# EAGLE schematic wifi-board (EAGLE 7.1.0)
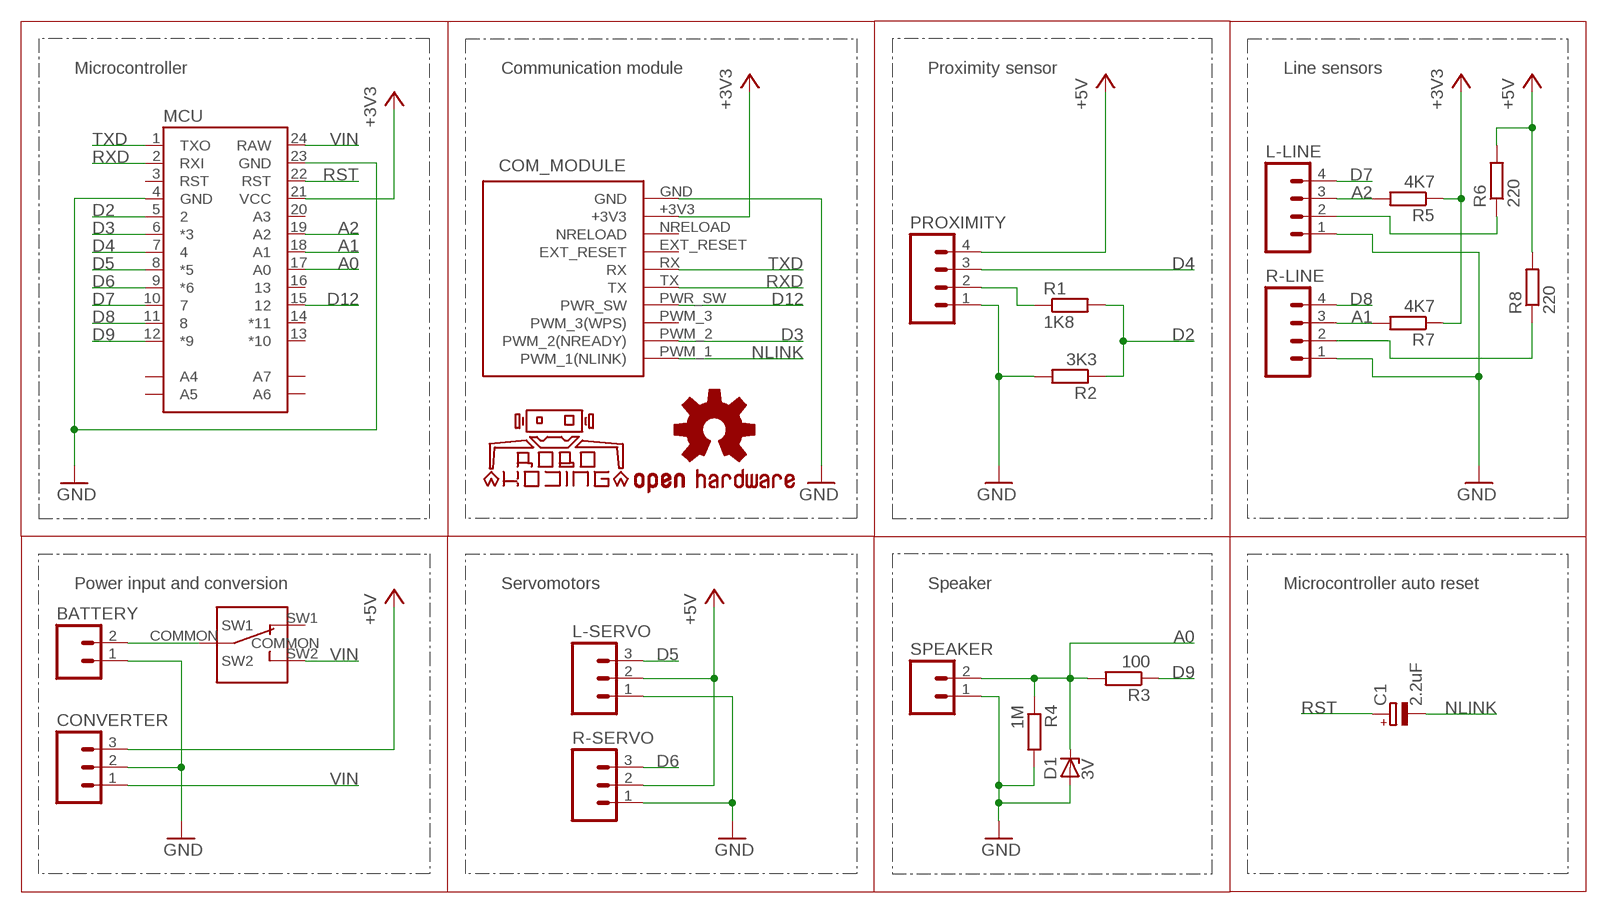
[diagram p0: schematic, sheet 1]

## Parts
BATTERY  M02LOCK_LONGPADS  [1X02_LOCK_LONGPADS]
C1  2.2uF  CPOL-EUE2-5  [E2-5]
COM_MODULE  USR_WIFI-T  [WIFI_MODULE-T]
CONVERTER  M03LOCK_LONGPADS  [1X03_LOCK_LONGPADS]
D1  3V  1N821  [DO35Z10]
L-LINE  M04LOCK_LONGPADS  [1X04_LOCK_LONGPADS]
L-SERVO  M03LOCK_LONGPADS  [1X03_LOCK_LONGPADS]
LOGO1  OSHW-LOGOM  [OSHW-LOGO-M]
LOGO2  ROBOKODING-LOGOM  [ROBOKODING-LOGO-M]
MCU  ARDUINO_PRO_MINI  [ARDUINO_PRO_MINI]
POWER  SPDT_SLIDE_SWITCH  [SPDT_SLIDE_SWITCH]
PROXIMITY  M04LOCK_LONGPADS  [1X04_LOCK_LONGPADS]
R1  1K8  R-EU_0204/5  [0204/5]
R2  3K3  R-EU_0204/5  [0204/5]
R3  100  R-EU_0204/5  [0204/5]
R4  1M  R-EU_0204/5  [0204/5]
R5  4K7  R-EU_0204/5  [0204/5]
R6  220  R-EU_0204/5  [0204/5]
R7  4K7  R-EU_0204/5  [0204/5]
R8  220  R-EU_0204/5  [0204/5]
R-LINE  M04LOCK_LONGPADS  [1X04_LOCK_LONGPADS]
R-SERVO  M03LOCK_LONGPADS  [1X03_LOCK_LONGPADS]
SPEAKER  M02LOCK_LONGPADS  [1X02_LOCK_LONGPADS]

## Nets
+3V3: COM_MODULE.+3V3 MCU.21(VCC) R5.1 R7.1
+5V: CONVERTER.3 L-SERVO.2 PROXIMITY.4 R6.2 R8.2 R-SERVO.2
A0: D1.C MCU.17(A0) R3.2 R4.1 SPEAKER.2
A1: MCU.18(A1) R7.2 R-LINE.3
A2: L-LINE.3 MCU.19(A2) R5.2
BAT_IN: BATTERY.2 POWER.COMMON
D2: MCU.5 R1.2 R2.1
D3: COM_MODULE.PWM_2(PWM_2(NREADY)) MCU.6(*3)
D4: MCU.7 PROXIMITY.3
D5: L-SERVO.3 MCU.8(*5)
D6: MCU.9(*6) R-SERVO.3
D7: L-LINE.4 MCU.10
D8: MCU.11 R-LINE.4
D9: MCU.12(*9) R3.1
D12: COM_MODULE.PWR_SW MCU.15
GND: BATTERY.1 COM_MODULE.GND CONVERTER.2 D1.A L-LINE.1 L-SERVO.1 MCU.4(GND) MCU.23(GND) PROXIMITY.1 R2.2 R4.2 R-LINE.1 R-SERVO.1 SPEAKER.1
N$1: PROXIMITY.2 R1.1
N$6: L-LINE.2 R6.1
N$7: R8.1 R-LINE.2
NLINK: C1.- COM_MODULE.PWM_1(PWM_1(NLINK))
RST: C1.+ MCU.22(RST)
RXD: COM_MODULE.TX MCU.2(RXI)
TXD: COM_MODULE.RX MCU.1(TXO)
VIN: CONVERTER.1 MCU.24(RAW) POWER.SW2
Unconnected: COM_MODULE.EXT_RESET COM_MODULE.NRELOAD COM_MODULE.PWM_3(PWM_3(WPS)) MCU.3(RST) MCU.13(*10) MCU.14(*11) MCU.16 MCU.20(A3) POWER.SW1

## Notes on the sheet
- Microcontroller | Communication module | Proximity sensor | Line sensors
- Power input and conversion | Servomotors | Speaker | Microcontroller auto reset

## Library data of the parts
BATTERY SPEAKER = SparkFun-Connectors:M02: Standard 2-pin 0.1" header. Use with - straight break away headers ( PRT-00116) - right angle break away headers (PRT-00553) - swiss pins (PRT-00743) - machine pins (PRT-00117) - female headers (PRT-00115) Molex polarized connector foot print use with: PRT-08233 with associated crimp pins and housings. 2.54_SCREWTERM for use with PRT-10571. 3.5mm Screw Terminal footprints for PRT-08084 5mm Screw Terminal footprints for use with PRT-08432
C1 = Child-Friendly-Parts:CPOL-EU: POLARIZED CAPACITOR, European symbol
COM_MODULE = usr_wifi:USR_WIFI-T: USR-WIFI232-T WiFi Module
CONVERTER L-SERVO R-SERVO = SparkFun-Connectors:M03: Header 3 Standard 3-pin 0.1" header. Use with straight break away headers (SKU : PRT-00116), right angle break away headers (PRT-00553), swiss pins (PRT-00743), machine pins (PRT-00117), and female headers (PRT-00115). Molex polarized connector foot print use with SKU : PRT-08232 with associated crimp pins and housings.
D1 = diode:1N821: Reference DIODE temperature compensated, 6,2 V
L-LINE PROXIMITY R-LINE = SparkFun-Connectors:M04: Header 4 Standard 4-pin 0.1" header. Use with straight break away headers (SKU : PRT-00116), right angle break away headers (PRT-00553), swiss pins (PRT-00743), machine pins (PRT-00117), and female headers (PRT-00115). Molex polarized connector foot print use with SKU : PRT-08231 with associated crimp pins and housings. 1MM SMD Version SKU: PRT-10208
LOGO1 = SparkFun-Aesthetics:OSHW-LOGO: Open Source Hardware Logo This logo indicates the piece of hardware it is found on incorporates a OSHW license and/or adheres to the definition of open source hardware found here: http://freedomdefined.org/OSHW
LOGO2 = robokoding-logo:ROBOKODING-LOGO: Robokoding logo This logo indicates that the piece of hardware was developed by the RoboKoding community. RoboKoding is a organisation that focuses on teaching everyone building and programming robots: http://www.robokoding.com
MCU = SparkFun-Boards:ARDUINO_PRO_MINI
POWER = custom:SPDT_SLIDE_SWITCH
R1-R8 = Child-Friendly-Parts:R-EU_: RESISTOR, European symbol